# Altium schematic sheet Mux.SchDoc
size 250 x 199 mm; DocumentNumber: 9; SheetNumber: 9; SheetTotal: 11
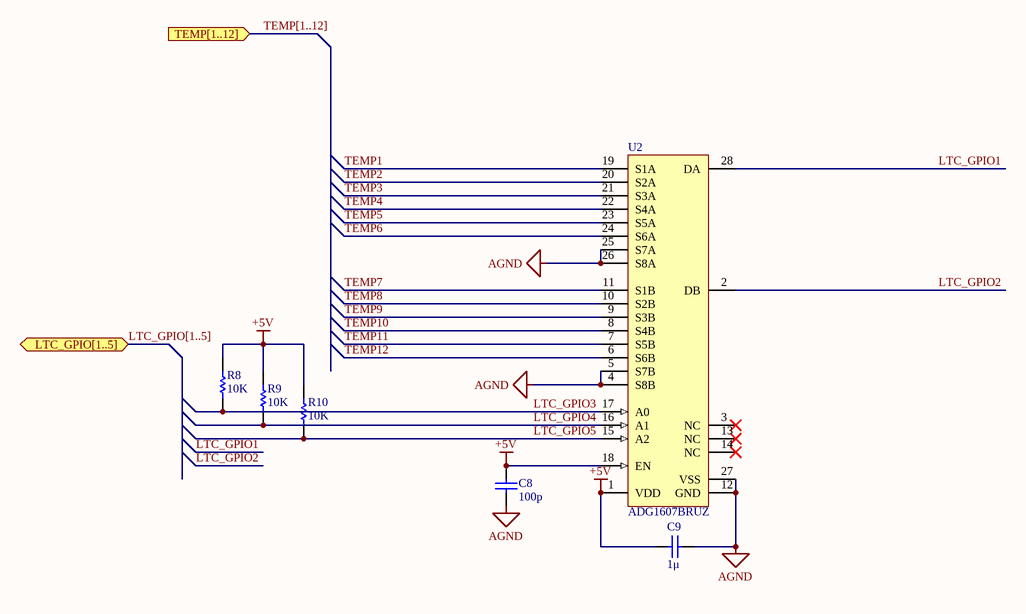
[diagram p0: Mux.SchDoc]

## Parts
C8  100p  [CAPC0603(1608)55_N]
C9  1μ  [CAPC0603(1608)55_N]
R8  10K  [RESC0603(1608)_N]
R9  10K  [RESC0603(1608)_N]
R10  10K  [RESC0603(1608)_N]
U2  ADG1607BRUZ  [ADI-RU-28_M]

## Ports
LTC_GPIO[1..5] (bidir), TEMP[1..12] (in)

## Nets
+5V: C8.2 C9.1 R8.2 R9.2 R10.2 U2.1(VDD) U2.18(EN)
AGND: C8.1 C9.2 U2.4(S8B) U2.5(S7B) U2.12(GND) U2.25(S7A) U2.26(S8A) U2.27(VSS)
LTC_GPIO1: U2.28(DA)
LTC_GPIO2: U2.2(DB)
LTC_GPIO3: R8.1 U2.17(A0)
LTC_GPIO4: R9.1 U2.16(A1)
LTC_GPIO5: R10.1 U2.15(A2)
TEMP1: U2.19(S1A)
TEMP2: U2.20(S2A)
TEMP3: U2.21(S3A)
TEMP4: U2.22(S4A)
TEMP5: U2.23(S5A)
TEMP6: U2.24(S6A)
TEMP7: U2.11(S1B)
TEMP8: U2.10(S2B)
TEMP9: U2.9(S3B)
TEMP10: U2.8(S4B)
TEMP11: U2.7(S5B)
TEMP12: U2.6(S6B)

Not connected (* = marked no-connect by the designer): U2 3(NC)* 13(NC)* 14(NC)*

## Buses and harness runs
bus LTC_GPIO[1..5] = port LTC_GPIO[1..5]
bus TEMP[1..12] = port TEMP[1..12]

## Library data of the parts
C8 = Cap 100p: Keramikvielschichtkondensator, SMD, Baureihe MC, ± 5%; Manufacturer: TDK; Voltage Rating: 50V; OC_MOUSER: CGA3E2C0G1H101J080AE; Value: 100p; PackageReference: 0603; Tolerance: ± 5%
C9 = Cap 1μ: Keramikvielschichtkondensator, SMD, Baureihe MC, ± 10%; Manufacturer: TDK; Voltage Rating: 50V; OC_MOUSER: CGA3E3X5R1H105K080AB; Value: 1μ; PackageReference: 0603; Tolerance: ± 10%
R8-R10 = Res 10K: Chipwiderstand, SMD, Baureihe MC, 1%; Manufacturer: Multicomp; Power: 100mW; PackageReference: 0603; Value: 10K; OC_FARNELL: 9330399
U2 = CMP-0793-00167-1: 4.5 Ohm Ron, Differential 8-Channel, +/-5 V, +12 V, +5 V, and +3.3 V Multiplexer, 28-pin SOP (RU-28), Tube; Manufacturer: Analog Devices; Bandwidth (Hz): 37M, 38M, 34M, 31M; Ron (ohms): 4; t transition (s): 143n; Max Analog Signal Range: Vss to Vdd; PackageDescription: 28-Pin Thin Shrink Small Outline Package, Body 9.7 x 4.4 mm, Pitch 0.65 mm; ComponentLink1URL: http://www.analog.com/en/index.html; ComponentLink2Description: Datasheet; ComponentLink3URL: http://www.analog.com/static/imported-files/packages/249854663RU_28.pdf; PackageVersion: Mar-05; Mounting Technology: Surface Mount; PartNumber: ADG1607BRUZ; Packing: Tube; ComponentLink1Description: Manufacturer URL; ComponentLink3Description: Package Specification; DatasheetVersion: Rev. 0; ComponentLink2URL: http://www.analog.com/static/imported-files/data_sheets/ADG1606_1607.pdf; Code_JEDEC: MO-153-AE; PackageReference: RU-28